# Altium schematic sheet Power Delivery.SchDoc
size A4; SheetNumber: 3; SheetTotal: 8
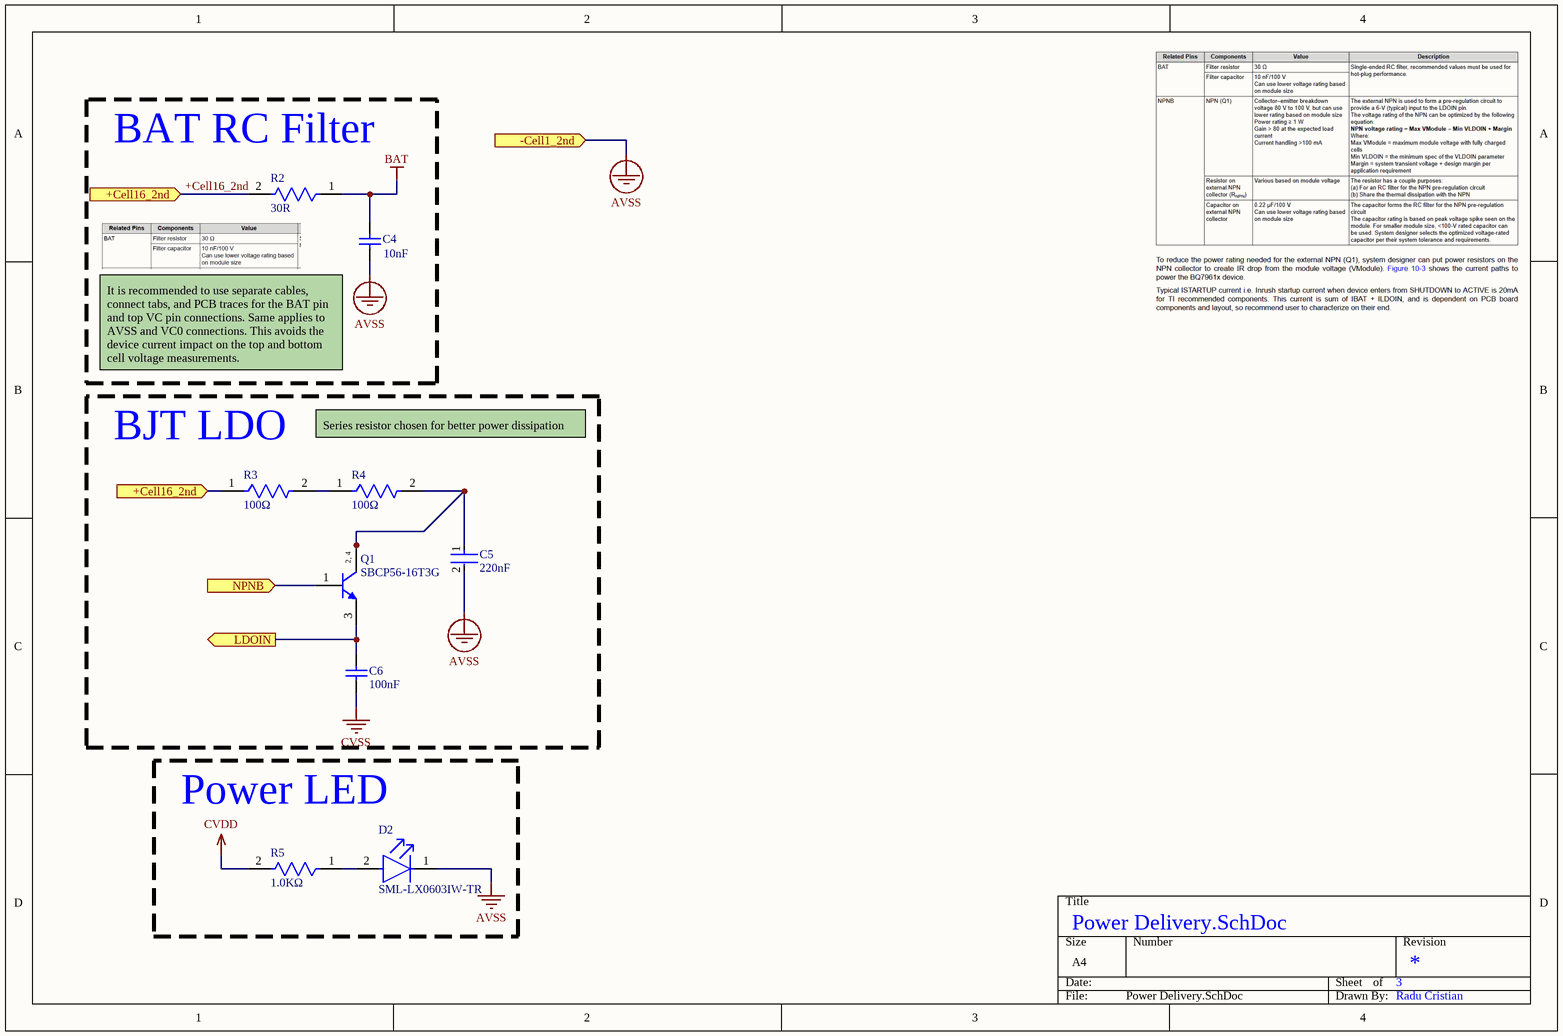
[diagram p0: Power Delivery.SchDoc]

## Parts
C4  Parameter 1: 10nF  [CAPC1608X92X38LL15T08]  (hidden comment: VJ0603Y103JXBAC)
C5  Capacitance: 220nF  [FP-0805-L_2_01_0_2-W_1_25-MFG]  (hidden comment: 08051C224K4T2A)
C6  Parameter 1: 100nF  [CAPC1608X92X38ML15T08]  (hidden comment: VJ0603Y104KXAAT)
D2  SML-LX0603IW-TR  [FP-SML-LX0603IW-TR-MFG]
Q1  SBCP56-16T3G  [ONSC-SOT-223-4-318E-04_V]
R2  Resistance: 30R  [FP-AC0603-IPC_C]  (hidden comment: AC0603FR-0730RL)
R3  Resistance: 100Ω  [FP-SR0805-MFG]  (hidden comment: SR0805FR-47100RL)
R4  Resistance: 100Ω  [FP-SR0805-MFG]  (hidden comment: SR0805FR-47100RL)
R5  Resistance: 1.0KΩ  [FP-CPF0603-MFG]  (hidden comment: CPF0603F1K0C1)

## Blocks framed on the sheet
BAT RC Filter: C4 R2
BJT LDO: C5 C6 Q1 R3 R4
Power LED: D2 R5

## Ports
+Cell16_2nd (in, see Connectors[2C], Power Delivery[1A]), +Cell16_2nd (in, see Connectors[2C], Power Delivery[1B]), -Cell1_2nd (in, see Connectors[1A]), LDOIN (out, see BQ chip[2B]), NPNB (in, see BQ chip[2B])

## Nets
AVSS: C4.1 C5.2 D2.1(C) ; port -Cell1_2nd
BAT: C4.2 R2.1
CVDD: R5.2
CVSS: C6.1
+Cell16_2nd: R2.2 R3.1 ; port +Cell16_2nd
LDOIN: C6.2 Q1.3(E) ; port LDOIN
NPNB: Q1.1(B) ; port NPNB
NetC5_1: C5.1 Q1.2(C) Q1.4(C) R4.2
NetD2_2: D2.2(A) R5.1
NetR3_2: R3.2 R4.1

## Notes on the sheet
- (near C4) It is recommended to use separate cables, connect tabs, and PCB traces for the BAT pin and top VC pin connections. Same applies to AVSS and VC0 connections. This avoids the device current impact on the top and bottom cell voltage measurements.
- Series resistor chosen for better power dissipation
- Radu Cristian
- (in symbol CMP-1048-00520-1) 2, 4

## Library data of the parts
C4 = CMP-2006-01162-1: Manufacturer: Vitramon; Part Number: VJ0603Y103JXBAC
C5 = CMP-04427-012849-1: Automotive Ceramic Capacitor, 0805, 220nF, 10%, X7R, 15%, 100V; Voltage Rating (DC): 100V; Dielectric: X7R; Length: 2.01mm; Contact Plating: Tin; Termination: Wraparound; Case/Package: 0805; RoHS Compliant: Yes; Tolerance: 10%; Max Operating Temperature: 125°C; Min Operating Temperature: -55°C; Mount: Surface Mount
C6 = CMP-2006-00164-1: Ceramic Capacitor, Multilayer, Ceramic, 50V, 10% +Tol, 10% -Tol, X7R, 15% TC, 0.1uF, Surface Mount, 0603; Manufacturer: Vishay; Part Number: VJ0603Y104KXAAT
D2 = CMP-57192-000012-1: LED RED DIFFUSED SMD; Luminous Intensity: 14mcd; Test Current: 20mA; Viewing Angle: 160°; Approvals: UL; Forward Voltage: 2V; Power Dissipation: 50mW; Dominant Wavelength: 635nm; Number of LEDs: 1; Lens Color: White; Height: 0.6mm; RoHS Compliant: Yes; Lead Free: Lead Free; Number of Pins: 2; Packaging: Tape and Reel; Case/Package: 0603; Length: 1.6mm; Color: Red; Max Operating Temperature: 85°C; Illumination Color: Red; Case Code (Metric): 1608; Diameter: 0.061inch; Min Operating Temperature: -25°C; Lens Style: Diffused; Mount: Surface Mount; Width: 0.8mm; Case Code (Imperial): 0603; Lens Transparency: Diffused; Wavelength: 635nm; Package Quantity: 1; Forward Current: 20mA
Q1 = CMP-1048-00520-1: NPN Silicon Epitaxial Transistor, 4-Pin SOT-223, Pb-Free, Tape and Reel; Manufacturer: On Semiconductor; IC Continuous (A): 1; RoHS: TRUE; ComponentLink1URL: http://www.onsemi.com/; PackageReference: SOT-223-4-318E-04; PackageDescription: 4-Pin Small Outline Transistor, Body 6.5 x 3.5 mm, Pitch 2.3 mm; PackageVersion: Rev. N, 08/2009; Polarity: NPN; ComponentLink1Description: Manufacturer URL; Mounting Technology: Surface Mount; PartNumber: SBCP56-16T3G; DatasheetVersion: Rev. 8; ComponentLink2URL: http://www.onsemi.com/pub_link/Collateral/BCP56T1-D.PDF; ComponentLink2Description: Datasheet; ComponentLink3URL: http://www.onsemi.com/pub_link/Collateral/318E-04.PDF; ComponentLink3Description: Package Specification; Packing: Tape and Reel
R2 = CMP-03412-028950-2: RES 30Ω 1.00% 0.1W 0603; Tolerance: 1%; Max Power Dissipation: 100mW; Temperature Coefficient: 100ppm/°C; Features: Moisture Resistant; Packaging: Tape and Reel; Number of Terminations: 2; Case/Package: 0603; Length: 0.063inch; Resistor Type: Thick Film; Series: AC; RoHS Compliant: Yes; Height: 0.022inch; Width: 0.031inch; Max Operating Temperature: 155°C; Min Operating Temperature: -55°C
R3 R4 = CMP-03412-018383-1: RES 100 OHM 1% 1/2W 0805; Manufacturer: Yageo; Automotive Grade: Grade 0; Value: 100Ω; Tolerance: 0.01; Power Rating: 0.5W; Voltage Rating: 150V; Lead Free: Yes; Temperature Range High: +155°C; Category: Res; Temperature: -55°C to +155°C; Device Class L3: Chip SMD Resistors; Device Class L1: Passive Components; Temperature Range Low: -55°C; Digikey Description: RES 100 OHM 1% 1/2W 0805; RoHS: TRUE; Series: SR; Package: SR0805; Ipc Land Pattern Name: RESC200125X50; ComponentLink2URL: http://www.yageo.com/documents/recent/PYu-SR_D_F%20tol_RoHS_L_3.pdf; Automotive: Yes; Octopart: https://octopart.com/sr0805fr-47100rl-yageo-91478093; Composition: Thick Film; Device Class L2: Resistors; Height: 0.6mm; ComponentLink2Description: Datasheet; Manufacturer Part Number: SR0805FR-47100RL; Footprint Url: http://www.yageo.com/exep/pages/download/literatures/PYu-R_Mount_10.pdf
R5 = CMP-03211-002621-1: RES SMD 1.0KΩ 1% 1/16W 0603; Manufacturer: TE Connectivity; Power Rating: 0.063W; Voltage Rating: 50V; Temperature Coefficient: 50ppm/°C; Octopart: https://octopart.com/cpf0603f1k0c1-te+connectivity-42013134; packaging: 1k Reel; Category: Res; Device Class L3: Chip SMD Resistors; octopart_url: https://octopart.com/cpf0603f1k0c1-te+connectivity-42013134; Value: 1.0KΩ; Temperature: -55°C to +155°C; Composition: Thin Film; ComponentLink2URL: https://www.te.com/commerce/DocumentDelivery/DDEController?Action=showdoc&DocId=Data+Sheet%7F1773200%7FM%7Fpdf%7FEnglish%7FENG_DS_1773200_M.pdf%7F3-1676481-2; Tolerance: 1%; Automotive: No; Lead Free: Yes; Height: 0.55mm; Device Class L1: Passive Components; Device Class L2: Resistors; Ipc Land Pattern Name: RESC15580X45; Series: CPF; ComponentLink2Description: Datasheet; RoHS: TRUE; Package: CPF0603; Manufacturer Part Number: CPF0603F1K0C1; Temperature Range Low: -55°C; Temperature Range High: +155°C